# EAGLE design T02_LED_Cube (EAGLE 7.7.0)
ECE 411 LED Cube Practicum project
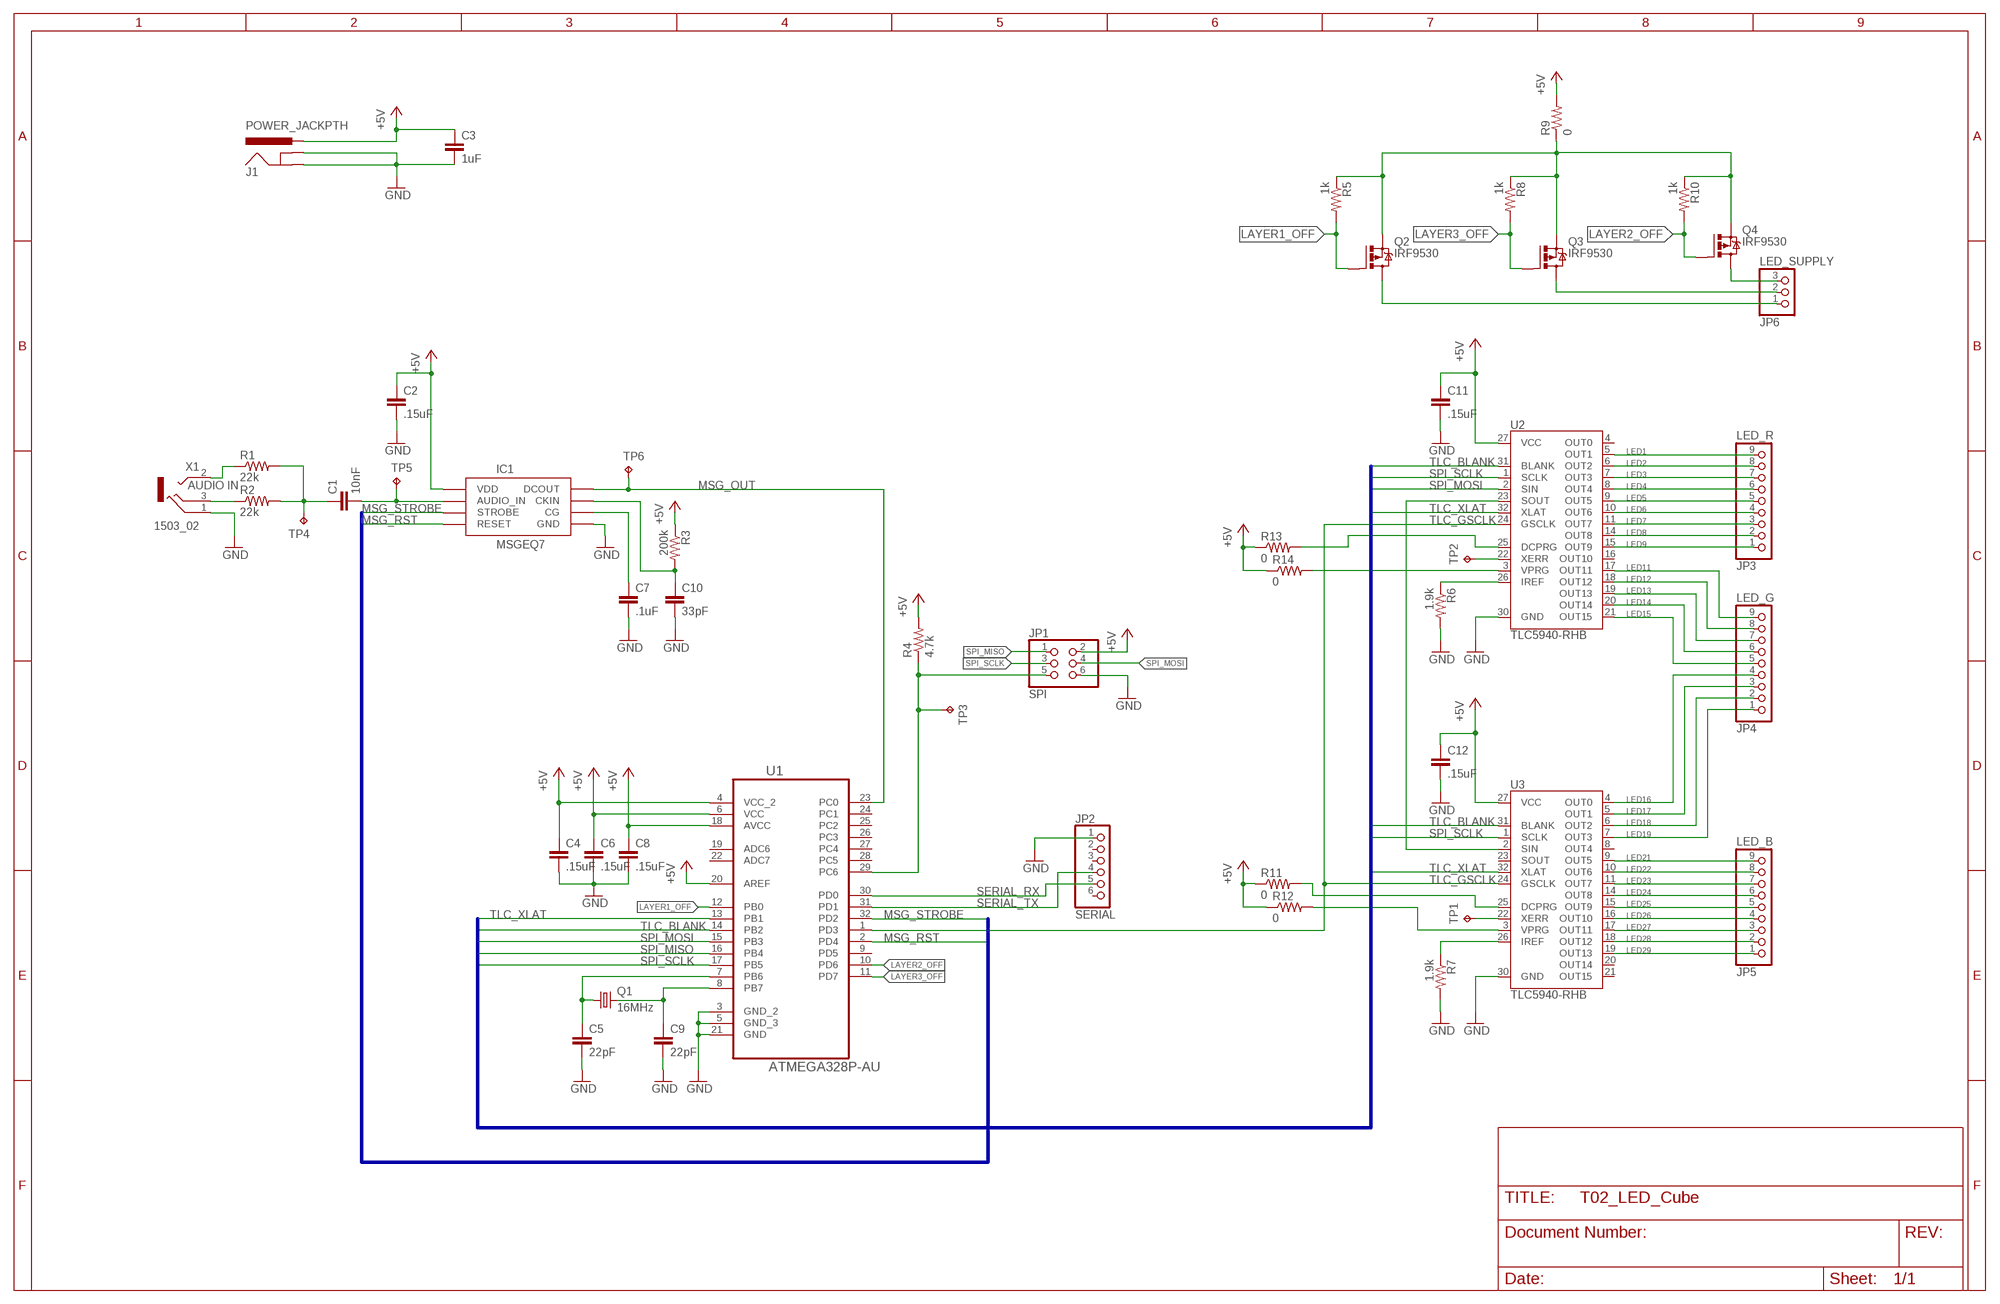
[diagram p0: schematic, sheet 1]

## Parts
C1  10nF  C-EUC0805  [C0805]
C2  .15uF  C-EUC0402  [C0402]
C3  1uF  C-EUC0805  [C0805]
C4  .15uF  C-EUC0402  [C0402]
C5  22pF  C-EUC0805  [C0805]
C6  .15uF  C-EUC0402  [C0402]
C7  .1uF  C-EUC0805  [C0805]
C8  .15uF  C-EUC0402  [C0402]
C9  22pF  C-EUC0805  [C0805]
C10  33pF  C-EUC0805  [C0805]
C11  .15uF  C-EUC0402  [C0402]
C12  .15uF  C-EUC0402  [C0402]
IC1  MSGEQ7SOIC  [SOIC8]
J1  POWER_JACKPTH  [POWER_JACK_PTH]
JP1  SPI  PINHD-2X3  [2X03]
JP2  SERIAL  PINHD-1X6  [1X06]
JP3  LED_R  PINHD-1X9  [1X09]
JP4  LED_G  PINHD-1X9  [1X09]
JP5  LED_B  PINHD-1X9  [1X09]
JP6  LED_SUPPLY  PINHD-1X3  [1X03]
Q1  16MHz  CRYSTALHC49UP  [HC49UP]
Q2  IRF9530  [TO220BV]
Q3  IRF9530  [TO220BV]
Q4  IRF9530  [TO220BV]
R1  22k  R-US_R0805  [R0805]
R2  22k  R-US_R0805  [R0805]
R3  200k  R-US_R0805  [R0805]
R4  4.7k  R-US_R0805  [R0805]
R5  1k  R-US_R0805  [R0805]
R6  1.9k  R-US_R0402  [R0402]
R7  1.9k  R-US_R0402  [R0402]
R8  1k  R-US_R0805  [R0805]
R9  0  R-US_R1210  [R1210]
R10  1k  R-US_R0805  [R0805]
R11  0  R-US_R0402  [R0402]
R12  0  R-US_R0402  [R0402]
R13  0  R-US_R0402  [R0402]
R14  0  R-US_R0402  [R0402]
TP1  TPPAD1-13  [P1-13]
TP2  TPPAD1-13  [P1-13]
TP3  TPPAD1-13  [P1-13]
TP4  TPPAD1-13  [P1-13]
TP5  TPPAD1-13  [P1-13]
TP6  TPPAD1-13  [P1-13]
U1  ATMEGA328P-AU  [QFP80P900X900X120-32N]
U2  TLC5940-RHB  [QFN-32]
U3  TLC5940-RHB  [QFN-32]
X1  1503_02  [1503_02]

## Nets
+5V: C2.1 C3.1 C4.1 C6.1 C8.1 C11.1 C12.1 IC1.1(VDD) J1.PWR JP1.2 R3.1 R4.2 R9.2 R11.1 R12.1 R13.1 R14.1 U1.4(VCC_2) U1.6(VCC) U1.18(AVCC) U1.20(AREF) U2.27(VCC) U3.27(VCC)
ATM_RST: JP1.5 R4.1 TP3.TP U1.29(PC6)
CRY_1: C5.1 Q1.1 U1.7(PB6)
CRY_2: C9.1 Q1.2 U1.8(PB7)
GND: C2.2 C3.2 C4.2 C5.2 C6.2 C7.2 C8.2 C9.2 C10.2 C11.2 C12.2 IC1.2(GND) J1.GND J1.GNDBREAK JP1.6 JP2.1 R6.2 R7.2 U1.3(GND_2) U1.5(GND_3) U1.21(GND) U2.30(GND) U3.30(GND) X1.1
LAY1_SUPPLY: JP6.1 Q2.D
LAY2_SUPPLY: JP6.3 Q4.D
LAY3_SUPPLY: JP6.2 Q3.D
LAYER1_OFF: Q2.G R5.2 U1.12(PB0)
LAYER2_OFF: Q4.G R10.2 U1.10(PD6)
LAYER3_OFF: Q3.G R8.2 U1.11(PD7)
LED1: JP3.9 U2.5(OUT1)
LED2: JP3.8 U2.6(OUT2)
LED3: JP3.7 U2.7(OUT3)
LED4: JP3.6 U2.8(OUT4)
LED5: JP3.5 U2.9(OUT5)
LED6: JP3.4 U2.10(OUT6)
LED7: JP3.3 U2.11(OUT7)
LED8: JP3.2 U2.14(OUT8)
LED9: JP3.1 U2.15(OUT9)
LED11: JP4.9 U2.17(OUT11)
LED12: JP4.8 U2.18(OUT12)
LED13: JP4.7 U2.19(OUT13)
LED14: JP4.6 U2.20(OUT14)
LED15: JP4.5 U2.21(OUT15)
LED16: JP4.4 U3.4(OUT0)
LED17: JP4.3 U3.5(OUT1)
LED18: JP4.2 U3.6(OUT2)
LED19: JP4.1 U3.7(OUT3)
LED21: JP5.9 U3.9(OUT5)
LED22: JP5.8 U3.10(OUT6)
LED23: JP5.7 U3.11(OUT7)
LED24: JP5.6 U3.14(OUT8)
LED25: JP5.5 U3.15(OUT9)
LED26: JP5.4 U3.16(OUT10)
LED27: JP5.3 U3.17(OUT11)
LED28: JP5.2 U3.18(OUT12)
LED29: JP5.1 U3.19(OUT13)
LED_SUPPLY: Q2.S Q3.S Q4.S R5.1 R8.1 R9.1 R10.1
MSG_CG: C7.1 IC1.6(CG)
MSG_CKIN: C10.1 IC1.8(CKIN) R3.2
MSG_INPUT: C1.2 IC1.5(AUDIO_IN) TP5.TP
MSG_OUT: IC1.3(DCOUT) TP6.TP U1.23(PC0)
MSG_RST: IC1.7(RESET) U1.2(PD4)
MSG_STROBE: IC1.4(STROBE) U1.32(PD2)
N$1: R2.1 X1.3
N$2: R1.1 X1.2
N$3: R12.2 U3.3(VPRG)
N$4: R14.2 U2.3(VPRG)
N$5: R11.2 U3.25(DCPRG)
N$6: R13.2 U2.25(DCPRG)
SERIAL_RX: JP2.5 U1.30(PD0)
SERIAL_TX: JP2.4 U1.31(PD1)
SPI_MISO: JP1.1 U1.16(PB4)
SPI_MOSI: JP1.4 U1.15(PB3) U2.2(SIN)
SPI_SCLK: JP1.3 U1.17(PB5) U2.1(SCLK) U3.1(SCLK)
TLC1_ERR: TP2.TP U2.22(XERR)
TLC1_IREF: R6.1 U2.26(IREF)
TLC2_ERR: TP1.TP U3.22(XERR)
TLC2_IREF: R7.1 U3.26(IREF)
TLC_BLANK: U1.14(PB2) U2.31(BLANK) U3.31(BLANK)
TLC_CHAIN: U2.23(SOUT) U3.2(SIN)
TLC_GSCLK: U1.1(PD3) U2.24(GSCLK) U3.24(GSCLK)
TLC_XLAT: U1.13(PB1) U2.32(XLAT) U3.32(XLAT)
UNFILTERED_INPUT: C1.1 R1.2 R2.2 TP4.TP
Unconnected: JP2.2 JP2.3 JP2.6 U1.9(PD5) U1.19(ADC6) U1.22(ADC7) U1.24(PC1) U1.25(PC2) U1.26(PC3) U1.27(PC4) U1.28(PC5) U2.4(OUT0) U2.16(OUT10) U3.8(OUT4) U3.20(OUT14) U3.21(OUT15) U3.23(SOUT) X1.2@2

## Buses
MSG_STROBE,MSG_RST
SPI_MOSI,SPI_MISO,SPI_SCLK,TLC_BLANK,TLC_XLAT

## Notes on the sheet
- AUDIO IN

## Library data of the parts
C1-C12 = rcl:C-EU: CAPACITOR, European symbol
IC1 = msgeq7:MSGEQ7: 7-band graphic equalizer
J1 = SparkFun-Connectors:POWER_JACK: Power Jack This is the standard 5.5mm barrel jack for power. The PTH is the most common, proven, reliable, footprint. The Slot footprint only works if the mill layer is transmitted to the PCB fab house so be warned. Mating wall wart : TOL-00298 (and others); PROD_ID: CONN-08197
JP1 = pinhead:PINHD-2X3: PIN HEADER
JP2 = pinhead:PINHD-1X6: PIN HEADER
JP3-JP5 = pinhead:PINHD-1X9: PIN HEADER
JP6 = pinhead:PINHD-1X3: PIN HEADER
Q1 = crystal:CRYSTAL: CRYSTAL; OC_FARNELL: unknown; OC_NEWARK: unknown
Q2-Q4 = transistor-power:IRF9530: P-CHANNEL HEXFET POWER-MOS-FET Source: http://www.irf.com/product-info/datasheets/data/irf9530.pdf
R1-R14 = rcl:R-US_: RESISTOR, American symbol
TP1-TP6 = testpad:TP: Test pad
U1 = Atmel_By_element14_Batch_1-00:ATMEGA328P-AU: 8-bit Microcontroller with In-System Programmable Flash; MPN: ATMEGA328P-AU; OC_FARNELL: 1715486; OC_NEWARK: 14R4631; PACKAGE: TQFP-32; SUPPLIER: Atmel
U2 U3 = SparkFun-DigitalIC:TLC5940: 16-channel LED Driver with Dot Correction and Grayscale PWM Control The TLC5940 is a 16-channel, constant-current sink LED driver. Each channel has an individually adjustable 4096-step grayscale PWM brightness control and a 64-step, constant-current sink (dot correction). The dot correction adjusts the brightness variations between LED channels and other LED drivers. The dot correction data is stored in an integrated EEPROM. Both grayscale control and dot correction are accessible via a serial interface. A single external resistor sets the maximum current value of all 16 channels. Packages: 28-pin HTSSOP 32-pin 5x5mm QFN 28-pin DIP; PROD_ID: IC-10398
X1 = con-lumberg:1503_02: Jack connectors according to JISC 6560, 3.5 mm Klinkeneinbaukupplung nach JISC 6560, 3,5 mm, 3-polig/stereo, abgewinkelte Ausführung, Surface-Mount-Technik (SMT) Source: http://www.lumberg.com/Produkte/PDFs/1503_02.pdf; OC_FARNELL: 1216979; OC_NEWARK: unknown

## Board
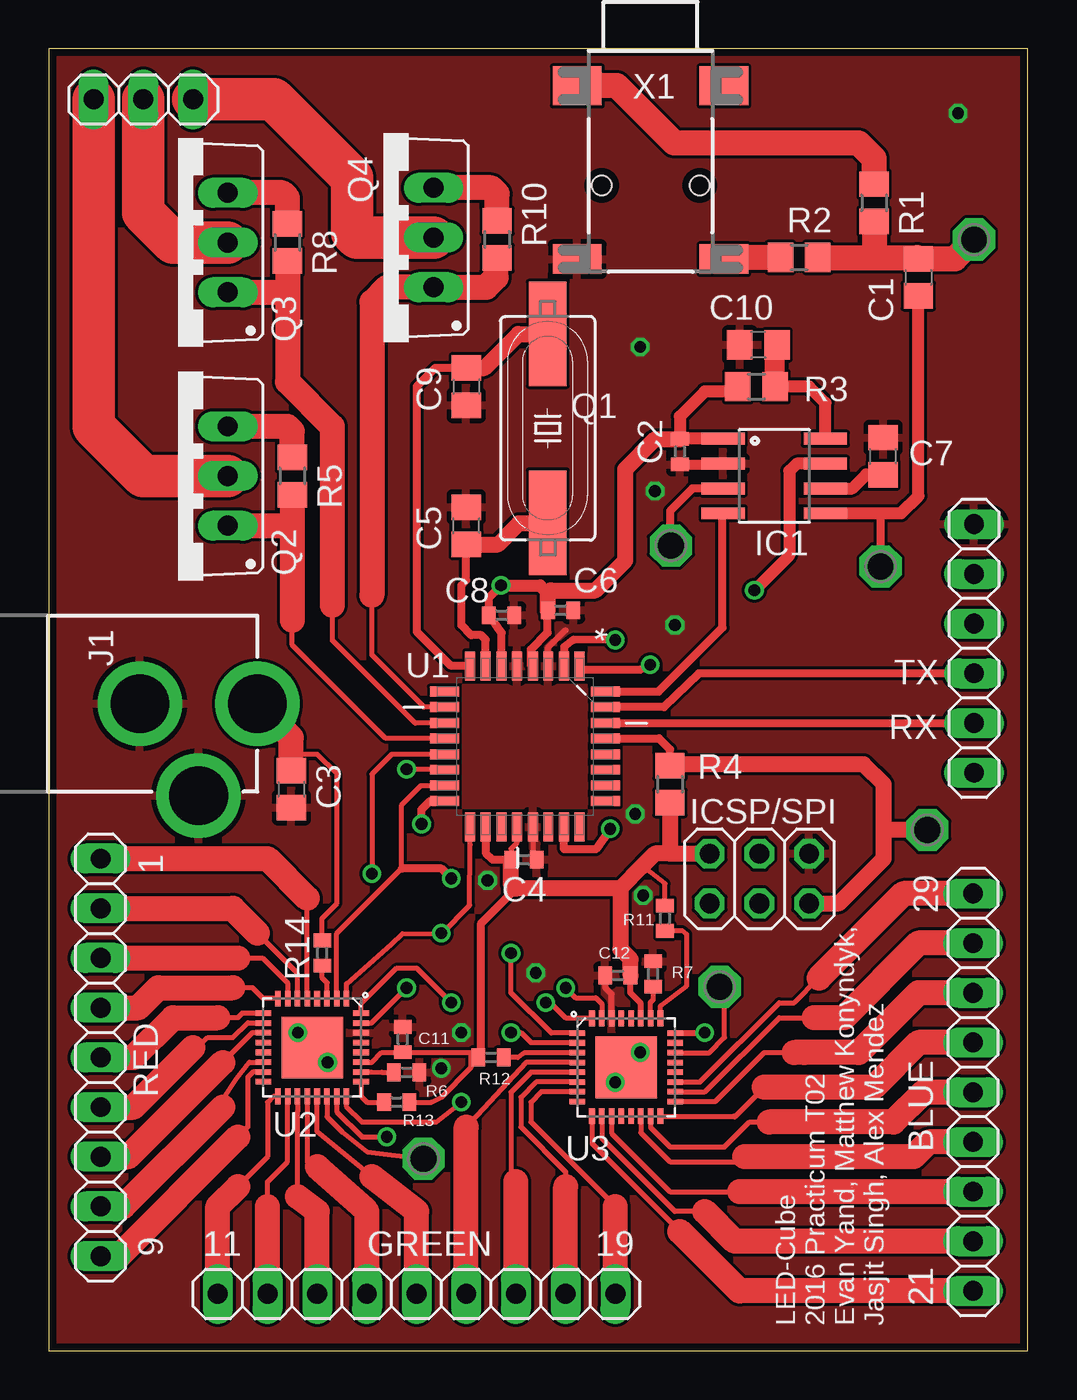
[diagram p1: board, top side]
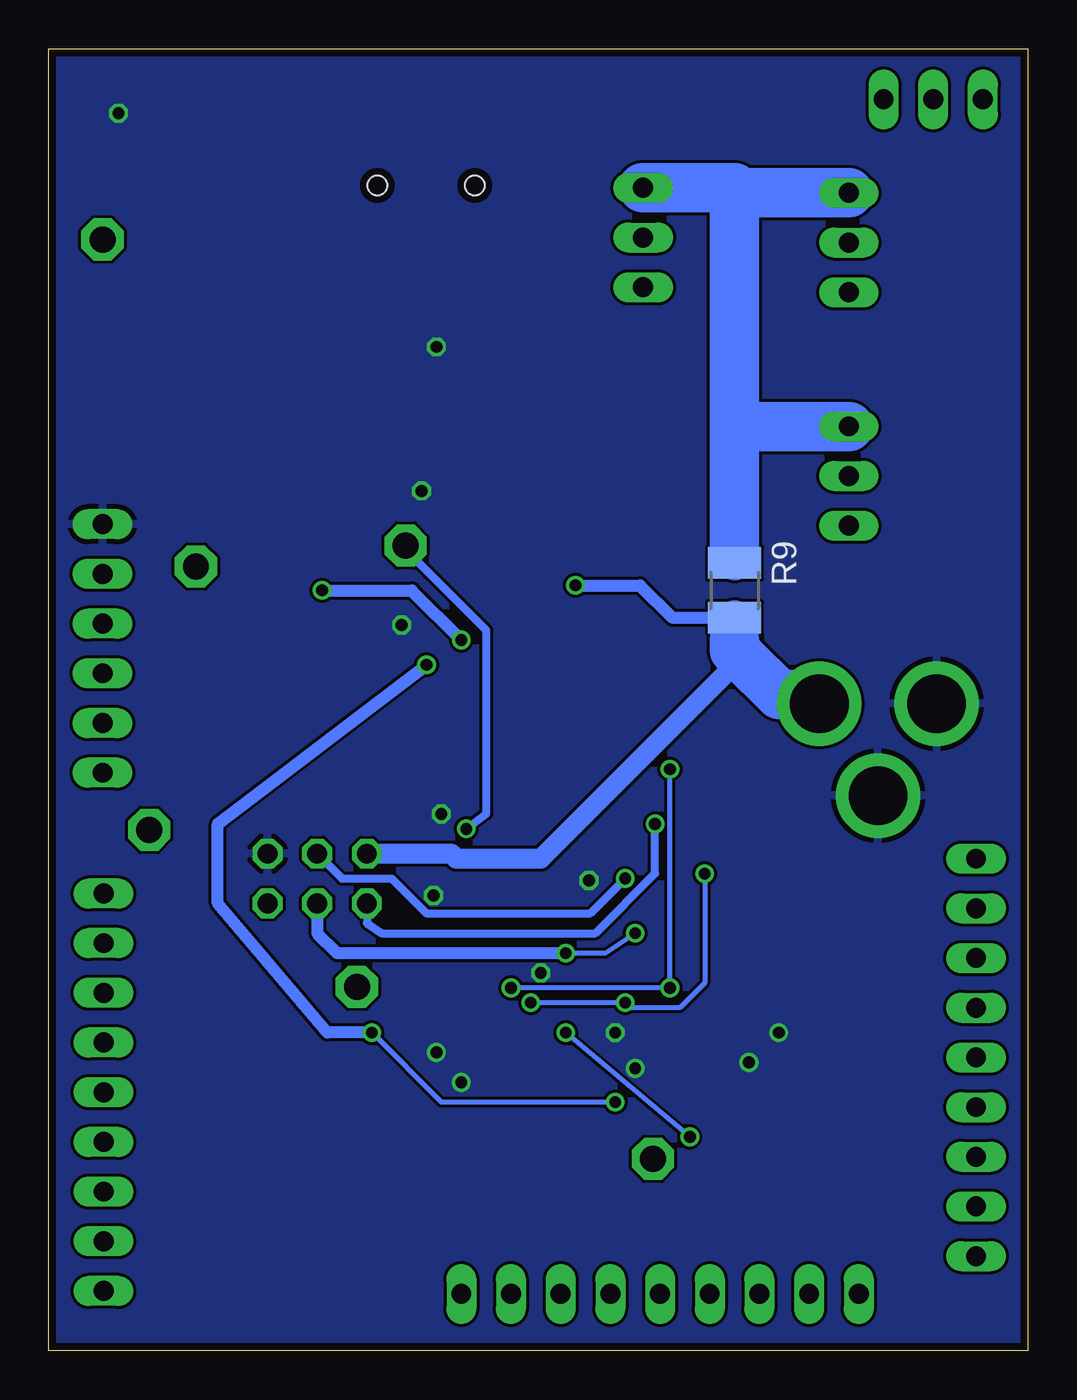
[diagram p2: board, bottom side, seen from below]

Size 50.04 x 66.54 mm. Coordinates in mm from the lower left corner, seen from the top.
Outline: 0,0 50.04,0 50.04,66.54 0,66.54 0,0
Copper layers (1*16): Top 0.0356mm / dielectric 1.5011mm / Bottom 0.0356mm
Design rules "oshpark-2layer": minimum track width 6mil, minimum drill 13mil, track to track 6mil, track to pad 6mil, pad to pad 6mil, via to via 6mil, smd to smd 6mil, copper to edge 15mil, drill to drill 6mil, minimum pad ring 7mil, minimum via ring 7mil, stop-mask expansion 2.5mil, vias tented up to drill 0mil, thermal gap 10mil

### Footprints (pad centres in the part's own frame; a part is rotated, then mirrored left to right if it is on the bottom)
C0805 = smd 1.3 x 1.5: 1 -0.95,0; 2 0.95,0
C0402 = smd 0.7 x 0.9: 1 -0.65,0; 2 0.65,0
SOIC8 = smd 0.61 x 2.21: 1 -1.905,-2.616; 2 -0.635,-2.616; 3 0.635,-2.616; 4 1.905,-2.616; 5 1.905,2.616; 6 0.635,2.616; 7 -0.635,2.616; 8 -1.905,2.616
POWER_JACK_PTH = drill 2.997 pad 4.318: GND 0,7.7; GNDBREAK 4.7,10.7; PWR 0,13.7
2X03 = drill 1.016 octagon: 1 -2.54,-1.27; 2 -2.54,1.27; 3 0,-1.27; 4 0,1.27; 5 2.54,-1.27; 6 2.54,1.27
1X06 = drill 1.016 long: 1 -6.35,0; 2 -3.81,0; 3 -1.27,0; 4 1.27,0; 5 3.81,0; 6 6.35,0
1X09 = drill 1.016 long: 1 -10.16,0; 2 -7.62,0; 3 -5.08,0; 4 -2.54,0; 5 0,0; 6 2.54,0; 7 5.08,0; 8 7.62,0; 9 10.16,0
1X03 = drill 1.016 long: 1 -2.54,0; 2 0,0; 3 2.54,0
HC49UP = smd 5.334 x 1.93: 1 -4.826,0; 2 4.826,0
TO220BV = drill 1.016 long: D 0,-2.54; G -2.54,-2.54; S 2.54,-2.54
R0805 = smd 1.3 x 1.5: 1 -0.95,0; 2 0.95,0
R0402 = smd 0.7 x 0.9: 1 -0.65,0; 2 0.65,0
R1210 = smd 1.6 x 2.7: 1 -1.4,0; 2 1.4,0
P1-13 = drill 1.321 pad 2.159 octagon: TP 0,0
QFP80P900X900X120-32N = smd 1.473 x 0.508: 1 -4.115,2.794; 2 -4.115,2.007; 3 -4.115,1.194; 4 -4.115,0.406; 5 -4.115,-0.406; 6 -4.115,-1.194; 7 -4.115,-2.007; 8 -4.115,-2.794; 17 4.115,-2.794; 18 4.115,-2.007; 19 4.115,-1.194; 20 4.115,-0.406; 21 4.115,0.406; 22 4.115,1.194; 23 4.115,2.007; 24 4.115,2.794 | smd 0.508 x 1.473: 9 -2.794,-4.115; 10 -2.007,-4.115; 11 -1.194,-4.115; 12 -0.406,-4.115; 13 0.406,-4.115; 14 1.194,-4.115; 15 2.007,-4.115; 16 2.794,-4.115; 25 2.794,4.115; 26 2.007,4.115; 27 1.194,4.115; 28 0.406,4.115; 29 -0.406,4.115; 30 -1.194,4.115; 31 -2.007,4.115; 32 -2.794,4.115
QFN-32 = smd 0.285 x 0.8: 1 -1.75,-2.5; 2 -1.25,-2.5; 3 -0.75,-2.5; 4 -0.25,-2.5; 5 0.25,-2.5; 6 0.75,-2.5; 7 1.25,-2.5; 8 1.75,-2.5; 17 1.75,2.5; 18 1.25,2.5; 19 0.75,2.5; 20 0.25,2.5; 21 -0.25,2.5; 22 -0.75,2.5; 23 -1.25,2.5; 24 -1.75,2.5 | smd 0.8 x 0.285: 9 2.5,-1.75; 10 2.5,-1.25; 11 2.5,-0.75; 12 2.5,-0.25; 13 2.5,0.25; 14 2.5,0.75; 15 2.5,1.25; 16 2.5,1.75; 25 -2.5,1.75; 26 -2.5,1.25; 27 -2.5,0.75; 28 -2.5,0.25; 29 -2.5,-0.25; 30 -2.5,-0.75; 31 -2.5,-1.25; 32 -2.5,-1.75 | smd 3.15 x 3.15: EP 0,0
1503_02 = smd 2.5 x 1.5: 1 -3.75,-10.75; 3 3.75,-10.75 | smd 2.5 x 2: 2 -3.75,-1.9; 2@2 3.75,-1.9 | hole 1: -2.5,-7; 2.5,-7

### Placement (x,y rotation side)
C1  44.45,54.86 270 top
C2  32.26,45.95 270 top
C3  12.4,28.7 270 top
C4  24.28,25.1 0 top
C5  21.34,42.16 90 top
C6  26.16,37.85 0 top
C7  42.65,45.72 90 top
C8  23.14,37.59 0 top
C9  21.34,49.28 270 top
C10  36.27,51.41 180 top
C11  18.08,15.9 90 top
C12  29.08,19.18 180 top
IC1  37.08,44.7 270 top
J1  -3.05,33.07 270 top
JP1  36.32,24.13 0 top
JP2  47.29,35.89 270 top
JP3  2.64,14.99 90 top
JP4  18.8,2.9 180 top
JP5  47.24,13.21 270 top
JP6  4.83,63.96 0 top
Q1  25.5,47.14 90 top
Q2  6.6,44.7 90 top
Q3  6.6,56.64 90 top
Q4  17.12,56.9 90 top
R1  42.19,58.67 270 top
R2  38.35,55.88 0 top
R3  36.17,49.28 0 top
R4  31.75,28.96 270 top
R5  12.45,44.7 270 top
R6  18.29,14.22 0 top
R7  30.89,19.25 90 top
R8  12.19,56.64 270 top
R9  14.99,38.86 270 bottom
R10  22.91,56.79 270 top
R11  31.5,22.1 270 top
R12  22.61,14.99 0 top
R13  17.78,12.7 180 top
R14  13.97,20.32 270 top
TP1  34.29,18.59 180 top
TP2  19.15,9.8 180 top
TP3  44.91,26.62 0 top
TP4  47.29,56.79 270 top
TP5  42.52,40.08 270 top
TP6  31.8,41.15 270 top
U1  24.33,30.89 270 top
U2  13.46,15.49 180 top
U3  29.51,14.48 270 top
X1  30.76,66.55 0 top

### Tracks (layer width: path | path; a pad name or v marks a point on that pad's centre or on a via)
+5V  (via drill 0.6)
  Top 0.254: U2.27 16.52,14.74 17.02,15.24 17.27,15.24 | 17.27,15.24 17.82,15.24 C11.1 | 22.1,15.23 21.95,15.23 | 21.95,15.23 21.59,15.23 | 21.59,15.23 17.28,15.23 17.27,15.24 | U1.20 23.93,25.96 23.62,25.65 23.62,25.11 C4.1 | 12.39,30.48 13.72,30.48 14.73,29.46 14.73,22.86 13.96,22.09 R14.1 | 21.59,15.23 21.59,14.48 20.07,12.95 19.56,12.7 R13.1 | R12.1 21.95,15.23 | R11.1 31.5,23.88 30.35,24.77
  Top 0.305: U3.27 30.27,17.74 29.72,18.29 29.72,19.16 C12.1
  Top 0.406: U1.18 22.33,25.45 22.68,25.09 C4.1 | U1.6 23.14,36.69 C8.1 22.49,38.49 v23.11,39.12 | U1.4 24.69,35 24.64,35.05 24.64,35.84 25.5,36.7 25.5,37.58 C6.1 | 22.1,15.23 22.1,21.84 23.88,23.62
  Top 0.61: IC1.1 32.27,46.61 C2.1 32.26,47.75 33.53,49.02 35.05,49.02 35.22,49.19 R3.1 | v23.11,39.12 25.12,39.12 25.51,38.72
  Top 0.813: R4.2 31.75,25.4 | 31.75,25.4 JP1.2 | 31.75,25.4 30.99,25.4 30.35,24.77 29.21,23.62 | 29.21,23.62 23.88,23.62 23.62,23.88 C4.1 | C6.1 25.51,38.72 25.65,38.86 27.94,38.86 29.46,40.39 29.46,45.06 30.99,46.58 32.24,46.58 C2.1 | 29.21,23.62 29.21,20.52 29.74,19.99 29.73,19.98 C12.1
  Top 1.27: C3.1 12.39,30.48 12.39,31.33 J1.PWR
  Bottom 0.61: v23.11,39.12 19.81,39.12 18.16,37.47 R9.2
  Bottom 1.016: JP1.2 29.46,25.4 29.21,25.15 24.89,25.15 14.61,35.43
  Bottom 1.778: R9.2 14.99,36.33 14.99,36.32
  Bottom 2.54: 14.99,36.32 14.99,35.81 14.61,35.43 12.7,33.53 11.11,33.53 J1.PWR
ATM_RST
  Top 0.406: U1.29 31.19,31.29 31.75,30.73 R4.1
  Top 0.813: JP1.5 40.39,22.86 42.67,25.15 42.67,26.67 | 42.67,26.67 42.67,28.96 41.66,29.97 31.94,29.97 R4.1 | TP3.TP 42.72,26.62 42.67,26.67
CRY_1
  Top 0.406: U1.7 22.33,36.35 22.1,36.58 21.59,36.58 21.08,37.08 21.08,39.12 21.34,39.37 C5.1
  Top 0.813: C5.1 22.95,41.21 24.03,42.29 25.48,42.29 Q1.1
CRY_2
  Top 0.406: C9.1 19.75,50.23 18.8,49.28 18.8,36.75 20.52,35.03 21.51,35.03 U1.8
  Top 0.813: C9.1 22.26,50.23 24,51.97 Q1.2
GND  (via drill 0.6)
  Top 0.254: 34.37,45.3 arc45 IC1.2 | U1.21 24.74,25.56 arc45 C4.2
  Top 0.305: U1.3 25.53,35.94 26.42,36.83 | U3.30 28.77,18.23 28.45,18.54 28.45,19.16 C12.2
  Top 0.508: C2.2 34.37,45.3
  other vias: 46.48,63.25 24.89,19.3 20.07,14.43 21.08,16.26 14.25,14.73 12.73,16.26 28.96,13.72 30.23,15.24 30.99,43.94 32,37.08 30.23,51.31 29.97,27.43 30.38,23.27 22.43,24.03
  pour Top: 0,66.29 0,0 50.04,0 49.78,66.55
  pour Bottom: 0,66.29 0,0 50.04,0 49.78,66.55
LAY1_SUPPLY
  Top 2.184: JP6.1 2.29,47.24 4.83,44.7 Q2.D
LAY2_SUPPLY
  Top 2.184: JP6.3 11.48,63.96 15.49,59.94 15.49,57.15 15.75,56.9 Q4.D
LAY3_SUPPLY
  Top 2.184: JP6.2 4.83,58.17 6.35,56.64 Q3.D
LAYER1_OFF
  Top 0.254: U1.12 17.22,31.29 12.45,36.07 12.45,36.83 12.7,37.08 12.45,37.34
  Top 1.27: R5.2 12.45,42.42 | 12.45,42.42 12.45,37.34 | Q2.G 12.19,42.16 12.45,42.42
LAYER2_OFF
  Top 0.254: U1.10 19.18,32.89 16.51,35.56 16.51,38.61
  Top 1.27: 16.51,38.61 16.51,53.59 17.27,54.36 Q4.G 22.35,54.36 22.86,54.86 22.86,55.79 R10.2
LAYER3_OFF
  Top 0.254: U1.11 18.72,32.08 14.48,36.32 14.48,38.1
  Top 1.27: R8.2 12.19,54.36 | 12.19,54.36 12.19,49.53 14.48,47.24 14.48,38.1 | Q3.G 11.94,54.1 12.19,54.36
LED1
  Top 0.254: U2.5 13.21,21.08 13.21,23.11
  Top 1.27: JP3.9 11.18,25.15 13.21,23.11
LED2
  Top 0.254: U2.6 12.71,19.29 10.67,21.34
  Top 1.27: JP3.8 9.4,22.61 10.67,21.34
LED3
  Top 0.254: 9.65,20.07 10.92,20.07 12.19,18.8 12.19,18.01 U2.7
  Top 1.27: JP3.7 9.65,20.07
LED4
  Top 0.254: U2.8 10.96,17.99 10.41,18.54 9.4,18.54
  Top 1.27: JP3.6 4.57,17.53 5.59,18.54 9.4,18.54
LED5
  Top 0.254: U2.9 9.88,17.24 9.65,17.02 8.64,17.02
  Top 1.27: JP3.5 4.32,14.99 6.35,17.02 8.64,17.02
LED6
  Top 0.254: 7.37,15.49 7.62,15.49 8.13,16 9.4,16 10.16,16.76 10.94,16.76 U2.10
  Top 1.27: JP3.4 4.32,12.45 7.37,15.49
LED7
  Top 0.254: 8.89,14.73 10.41,16.26 10.95,16.26 U2.11
  Top 1.27: JP3.3 4.06,9.91 8.89,14.73
LED8
  Top 0.254: 8.89,12.45 8.84,12.78 9.58,13.89 10.25,14.74 U2.14
  Top 1.27: JP3.2 3.81,7.37 8.89,12.45
LED9
  Top 0.254: U2.15 10.43,14.24 10.16,13.97 10.16,11.43 9.65,10.92
  Top 1.27: JP3.1 3.56,4.83 9.65,10.92
LED11
  Top 0.254: U2.17 11.47,12.99 11.18,12.7 11.18,9.91 9.65,8.38
  Top 1.27: JP4.9 8.64,7.37 9.65,8.38
LED12
  Top 0.254: 11.18,7.37 11.18,8.64 12.19,9.65 12.19,12.97 U2.18
  Top 1.27: JP4.8 11.18,7.37
LED13
  Top 0.254: U2.19 12.71,12.2 12.7,12.19 12.7,7.87
  Top 1.27: JP4.7 13.72,7.11 12.7,7.87
LED14
  Top 0.254: U2.20 13.21,9.65 16.13,7.24
  Top 1.27: JP4.6 16.26,7.11 16.13,7.24 13.72,9.4
LED15
  Top 0.254: 16.51,8.89 13.72,11.18 U2.21
  Top 1.27: JP4.5 18.8,7.11 16.51,8.89
LED16
  Top 0.254: U3.4 24.38,14.73 21.59,11.68 21.34,11.43
  Top 1.27: JP4.4 21.34,11.43
LED17
  Top 0.254: U3.5 24.64,14.23 23.62,13.21 23.62,8.89 23.88,8.64
  Top 1.27: JP4.3 23.88,8.64
LED18
  Top 0.254: U3.6 24.9,13.73 24.13,12.95 24.13,11.43 26.42,9.14 26.42,8.38
  Top 1.27: JP4.2 26.42,8.38
LED19
  Top 0.254: U3.7 25.17,13.23 24.64,12.7 24.64,11.68 28.96,7.37
  Top 1.27: JP4.1 28.96,7.37
LED21
  Top 0.254: U3.9 27.77,10.59 32.26,6.1
  Top 1.27: JP5.9 35.31,3.05 32.26,6.1
LED22
  Top 0.254: U3.10 28.27,10.85 32,7.11 33.53,7.11
  Top 1.27: JP5.8 35.05,5.59 33.53,7.11
LED23
  Top 0.254: U3.11 28.77,11.11 31.75,8.13 35.31,8.13
  Top 1.27: JP5.7 35.31,8.13
LED24
  Top 0.254: U3.14 30.27,11.14 31.75,9.65 35.31,9.65 35.56,9.91
  Top 1.27: JP5.6 44.96,10.67 44.2,9.91 35.56,9.91
LED25
  Top 0.254: U3.15 30.77,11.4 31.75,10.41 34.54,10.41 35.81,11.68 36.83,11.68
  Top 1.27: JP5.5 44.7,13.21 43.18,11.68 36.83,11.68
LED26
  Top 0.254: U3.16 35.01,11.98 | 35.01,11.98 35.05,11.94 | 35.01,11.98 35.09,11.98 36.58,13.46
  Top 1.27: JP5.4 44.45,15.75 42.16,13.46 36.58,13.46
LED27
  Top 0.254: U3.17 34.06,12.73 36.58,15.24 38.61,15.24
  Top 1.27: JP5.3 44.45,18.29 41.4,15.24 38.61,15.24 38.1,15.24
LED28
  Top 0.254: U3.18 33.55,13.23 37.34,17.02 39.12,17.02
  Top 1.27: JP5.2 44.45,20.83 40.64,17.02 39.12,17.02
LED29
  Top 0.254: U3.19 33.29,13.73 37.34,17.78 38.1,17.78 39.37,19.05
  Top 1.27: JP5.1 43.69,23.37 39.37,19.05
LED_SUPPLY
  Top 1.27: R5.1 12.45,46.99 12.19,47.24 Q2.S | R8.1 12.19,58.93 11.94,59.18 Q3.S | R10.1 22.91,59.13 22.61,59.44 Q4.S
  Bottom 1.778: R9.1 14.99,41.15
  Bottom 2.54: 14.99,41.15 14.99,47.24 | 14.99,47.24 14.99,59.18 | 14.99,59.18 14.99,59.44 Q4.S | Q3.S 14.99,59.18 | Q2.S 14.99,47.24
MSG_CG
  Top 0.61: IC1.6 41.07,44.07 41.78,44.78 42.64,44.78 C7.1
MSG_CKIN
  Top 0.61: IC1.8 39.7,48.44 38.86,49.28 R3.2
  Top 1.016: R3.2 37.12,51.31 C10.1
MSG_INPUT
  Top 0.406: TP5.TP 42.52,42.65 42.67,42.8
  Top 0.61: IC1.5 42.67,42.8 43.56,42.8 44.45,43.69 C1.2
MSG_OUT  (via drill 0.6)
  Top 0.406: IC1.3 32.89,44.07 31.75,42.93 31.75,41.45 TP6.TP | v28.7,26.67 27.96,25.63 26.34,25.63 U1.23
  Bottom 0.406: TP6.TP 31.5,40.64 27.69,36.83 27.69,27.43 v28.7,26.67
MSG_RST  (via drill 0.6)
  Top 0.406: v28.96,36.32 26.82,36.35 26.34,35.97 U1.2
  Top 0.61: IC1.7 38.23,45.34 37.85,44.96 37.85,40.64 v36.07,38.86
  Bottom 0.61: v36.07,38.86 31.5,38.86 v28.96,36.32
MSG_STROBE
  Top 0.406: U1.32 31.17,33.68 34.44,36.96 34.44,42.77 IC1.4
N$1
  Top 1.27: R2.1 34.59,55.88 X1.3
N$2
  Top 1.27: R1.1 42.19,60.94 41.4,61.72 31.98,61.72 29.03,64.67 27.03,64.67 X1.2
N$3
  Top 0.254: U3.3 24.28,15.21 23.98,14.99 R12.2
N$4
  Top 0.254: U2.3 14.22,18.8 13.97,19.05 R14.2
N$5
  Top 0.254: U3.25 31.27,17.63 32.61,18.64 32.61,21.29 32.38,21.46 R11.2
N$6
  Top 0.254: U2.25 15.96,13.05 arc45 16,12.95 16.26,12.7 R13.2
SERIAL_RX
  Top 0.406: U1.30 JP2.5
SERIAL_TX
  Top 0.406: JP2.4 33.22,34.62 31.45,32.89 U1.31
SPI_MISO  (via drill 0.6)
  Top 0.406: v19.05,26.92 19.05,27.66 19.48,28.09 U1.16
  Bottom 0.406: JP1.1 33.78,21.84 33.02,21.34 22.1,21.34 19.05,24.38 v19.05,26.92
SPI_MOSI  (via drill 0.6)
  Top 0.254: U2.2 14.71,21.32 18.03,24.64 18.03,27.89 19.02,28.88 U1.15
  Top 0.406: v20.57,24.13 20.07,24.64 18.03,24.64
  Bottom 0.406: JP1.4 35.05,24.13 32.51,24.13 30.73,22.35 22.35,22.35 v20.57,24.13
SPI_SCLK  (via drill 0.6)
  Top 0.254: U3.1 25.68,16.23 23.62,18.29 v23.62,20.32 | U1.17 21.54,25.86 21.51,22.76 20.09,21.34 v20.07,21.34 18.06,21.31 17.52,20.8 15.21,18.75 U2.1
  Bottom 0.254: v23.62,20.32 21.59,20.32 v20.07,21.34
  Bottom 0.61: JP1.3 36.32,21.34 35.31,20.32 v23.62,20.32
TLC1_ERR
  Top 0.254: U2.22 14.21,11.95 14.99,11.18 16.26,10.16 TP2.TP
TLC1_IREF
  Top 0.254: U2.26 16.49,14.24 17.02,14.22 R6.1
TLC2_ERR
  Top 0.254: U3.22 33.77,15.23 34.54,16 34.54,18.34 TP1.TP
TLC2_IREF
  Top 0.254: R7.1 30.89,17.93 30.73,17.78 30.73,17.01 U3.26
TLC_BLANK  (via drill 0.6)
  Top 0.254: U2.31 16.49,16.74 v18.29,18.54 | v26.42,18.54 26.92,18.03 27.96,18.03 28.27,17.73 U3.31 | v18.29,29.72 20.19,29.72 U1.14
  Bottom 0.254: v26.42,18.54 v18.29,18.54 v18.29,29.72
TLC_CHAIN  (via drill 0.6)
  Top 0.254: U2.23 14.71,12.21 16,10.92 v17.27,10.92 | v23.62,16.26 24.13,16.26 24.64,15.75 27,15.75 U3.2
  Bottom 0.254: v17.27,10.92 v23.62,16.26
TLC_GSCLK  (via drill 0.6)
  Top 0.254: U2.24 15.2,12.49 16,11.68 19.81,11.68 v21.08,12.7
  Top 0.305: U3.24 33.5,16.23 v33.53,16.26
  Top 0.406: U1.1 27.13,34.85 27.18,34.8 30.23,34.8 v30.73,35.05
  Bottom 0.254: v21.08,12.7 29.97,12.7 v33.53,16.26
  Bottom 0.61: v33.53,16.26 35.81,16.26 41.4,22.86 41.4,26.92 v30.73,35.05
TLC_XLAT  (via drill 0.6)
  Top 0.254: U2.32 15.96,17.74 17.78,19.56 18.8,19.56 v20.57,17.78 | v25.4,17.78 25.65,17.78 26.42,17.02 27.73,17.02 U3.32 | U1.13 17.53,30.48 16.51,29.46 v16.51,24.38
  Bottom 0.254: v25.4,17.78 v20.57,17.78 20.32,17.53 17.78,17.53 16.51,18.8 v16.51,24.38
UNFILTERED_INPUT
  Top 1.27: R2.2 41.91,55.88 | 41.91,55.88 44.38,55.88 C1.1 46.31,55.81 TP4.TP | R1.2 42.19,56.16 41.91,55.88

### Text on the board
tNames: TX | RX | ICSP/SPI | 1 | 29 | RED | BLUE | 9 | 11 | GREEN | 19 | 21 | LED-Cube / 2016 Practicum T02 / Evan Yand, Matthew Konyndyk, / Jasjit Singh, Alex Mendez